# Altium project Cosmic_Luna_Board_Alpha_V0.00.PrjPcb
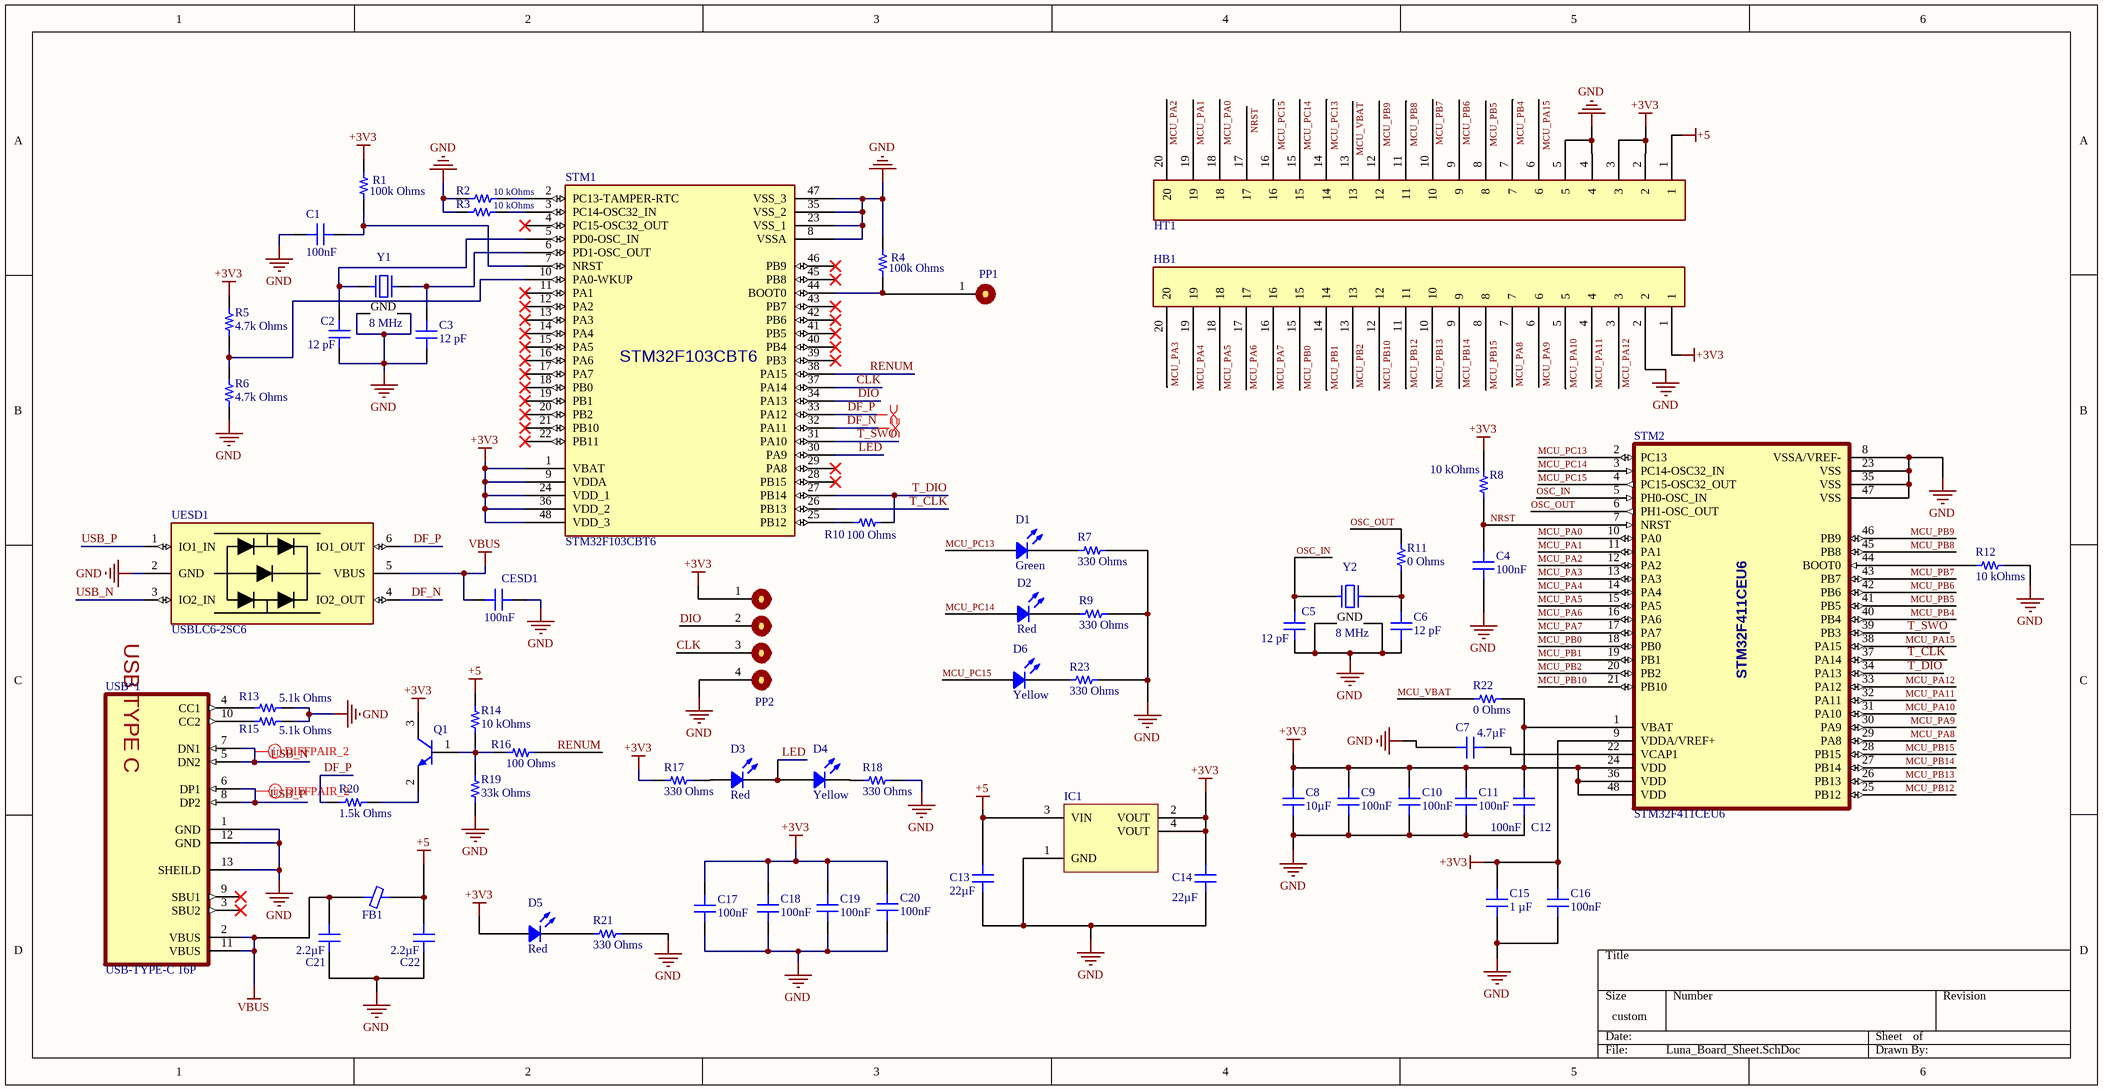
[diagram p0: Luna_Board_Sheet.SchDoc]
1 sheet, 65 parts. Net scope: global (net labels, ports and power ports of the same name join across sheets).
Board file: Luna_Board_PCB_D0.PcbDoc

## Sheet Luna_Board_Sheet.SchDoc
size 393 x 203 mm

### Parts
C1  100nF  [CAP 0603_1608]
C2  12 pF  [CAP 0603_1608]
C3  12 pF  [CAP 0603_1608]
C4  100nF  [CAP 0603_1608]
C5  12 pF  [CAP 0603_1608]
C6  12 pF  [CAP 0603_1608]
C7  4.7µF  [CAP 0603_1608]
C8  10µF  [CAP 0603_1608]
C9  100nF  [CAP 0603_1608]
C10  100nF  [CAP 0603_1608]
C11  100nF  [CAP 0603_1608]
C12  100nF  [CAP 0603_1608]
C13  22µF  [CAP 0805_2012]
C14  22µF  [CAP 0805_2012]
C15  1 µF  [CAP 0603_1608]
C16  100nF  [CAP 0603_1608]
C17  100nF  [CAP 0603_1608]
C18  100nF  [CAP 0603_1608]
C19  100nF  [CAP 0603_1608]
C20  100nF  [CAP 0603_1608]
C21  2.2µF  [CAP 0603_1608]
C22  2.2µF  [CAP 0603_1608]
CESD1  100nF  [CAP 0603_1608]
D1  Green  [LED 0805_2012 GREEN]
D2  Red  [LED 0805_2012 RED]
D3  Red  [LED 0805_2012 RED]
D4  Yellow  [LED 0805_2012 YELLOW]
D5  Red  [LED 0805_2012 RED]
D6  Yellow  [LED 0805_2012 YELLOW]
FB1  Ferrite Bead  [FER 0603_1608]  (value not drawn)
HB1  2.54mm_TH_1x20_pin_header  [2.54mm_TH_1x20_pin_header]  (value not drawn)
HT1  2.54mm_TH_1x20_pin_header  [2.54mm_TH_1x20_pin_header]  (value not drawn)
IC1  AMS1117-3.3  [ST SOT-223]  (value not drawn)
PP1  pin_pad_1  [pinpad_1]  (value not drawn)
PP2  pin_pad_4  [pinpad_4]  (value not drawn)
Q1  500mA NPN BJT  [DIODES SOT-23-3]  (value not drawn)
R1  100k Ohms  [RES 0603_1608]
R2  10 kOhms  [RES 0603_1608]
R3  10 kOhms  [RES 0603_1608]
R4  100k Ohms  [RES 0603_1608]
R5  4.7k Ohms  [RES 0603_1608]
R6  4.7k Ohms  [RES 0603_1608]
R7  330 Ohms  [RES 0603_1608]
R8  10 kOhms  [RES 0603_1608]
R9  330 Ohms  [RES 0603_1608]
R10  100 Ohms  [RES 0603_1608]
R11  0 Ohms  [RES 0603_1608]
R12  10 kOhms  [RES 0603_1608]
R13  5.1k Ohms  [RES 0603_1608]
R14  10 kOhms  [RES 0603_1608]
R15  5.1k Ohms  [RES 0603_1608]
R16  100 Ohms  [RES 0603_1608]
R17  330 Ohms  [RES 0603_1608]
R18  330 Ohms  [RES 0603_1608]
R19  33k Ohms  [RES 0603_1608]
R20  1.5k Ohms  [RES 0603_1608]
R21  330 Ohms  [RES 0603_1608]
R22  0 Ohms  [RES 0603_1608]
R23  330 Ohms  [RES 0603_1608]
STM1  STM32F103CBT6  [STM32F103CBT6_FOOTPRINT]
STM2  STM32F411CEU6  [STM32F411CEU6_Footprint]
UESD1  USBLC6-2SC6  [USBLC6-2SC6_Footprint]
USB*1  USB-TYPE-C 16P  [USB TYPE-C 24P SMD]
Y1  8 MHz  [EPSON TSX-3225]
Y2  8 MHz  [EPSON TSX-3225]

### Nets
+3V3: C8.2 C9.2 C10.2 C11.2 C12.2 C14.2 C15.2 C16.2 C17.2 C18.2 C19.2 C20.2 D5.1 HB1.1 HT1.2 HT1.3 IC1.2(VOUT) IC1.4(VOUT) PP2.1 Q1.3(C) R1.1 R5.2 R8.1 R17.1 R22.1 STM1.1(VBAT) STM1.9(VDDA) STM1.24(VDD_1) STM1.36(VDD_2) STM1.48(VDD_3) STM2.1(VBAT) STM2.9(VDDA/VREF+) STM2.24(VDD) STM2.36(VDD) STM2.48(VDD)
+5: C13.2 C22.1 FB1.1 HT1.1 IC1.3(VIN) R14.2
GND: C1.1 C2.1 C3.1 C4.1 C5.1 C6.1 C7.2 C8.1 C9.1 C10.1 C11.1 C12.1 C13.1 C14.1 C15.1 C16.1 C17.1 C18.1 C19.1 C20.1 C21.2 C22.2 CESD1.1 HB1.2 HT1.4 HT1.5 IC1.1(GND) PP2.4 R2.1 R3.1 R4.1 R6.1 R7.2 R9.2 R12.1 R13.2 R15.2 R18.2 R19.1 R21.2 R23.2 STM1.8(VSSA) STM1.23(VSS_1) STM1.35(VSS_2) STM1.47(VSS_3) STM2.8(VSSA/VREF-) STM2.23(VSS) STM2.35(VSS) STM2.47(VSS) UESD1.2(GND) USB*1.1(GND) USB*1.12(GND) USB*1.13(SHEILD) Y1.2(GND) Y1.4(GND) Y2.2(GND) Y2.4(GND)
VBUS: C21.1 CESD1.2 FB1.2 UESD1.5(VBUS) USB*1.2(VBUS) USB*1.11(VBUS)
CLK: PP2.3 STM1.37(PA14)
DF_N: STM1.32(PA11) UESD1.4(IO2_OUT)
DF_P: R20.1 STM1.33(PA12) UESD1.6(IO1_OUT)
DIO: PP2.2 STM1.34(PA13)
LED: D3.2 D4.1 STM1.30(PA9)
MCU_PA0: HT1.18 STM2.10(PA0)
MCU_PA1: HT1.19 STM2.11(PA1)
MCU_PA2: HT1.20 STM2.12(PA2)
MCU_PA3: HB1.20 STM2.13(PA3)
MCU_PA4: HB1.19 STM2.14(PA4)
MCU_PA5: HB1.18 STM2.15(PA5)
MCU_PA6: HB1.17 STM2.16(PA6)
MCU_PA7: HB1.16 STM2.17(PA7)
MCU_PA8: HB1.7 STM2.29(PA8)
MCU_PA9: HB1.6 STM2.30(PA9)
MCU_PA10: HB1.5 STM2.31(PA10)
MCU_PA11: HB1.4 STM2.32(PA11)
MCU_PA12: HB1.3 STM2.33(PA12)
MCU_PA15: HT1.6 STM2.38(PA15)
MCU_PB0: HB1.15 STM2.18(PB0)
MCU_PB1: HB1.14 STM2.19(PB1)
MCU_PB2: HB1.13 STM2.20(PB2)
MCU_PB4: HT1.7 STM2.40(PB4)
MCU_PB5: HT1.8 STM2.41(PB5)
MCU_PB6: HT1.9 STM2.42(PB6)
MCU_PB7: HT1.10 STM2.43(PB7)
MCU_PB8: HT1.11 STM2.45(PB8)
MCU_PB9: HT1.12 STM2.46(PB9)
MCU_PB10: HB1.12 STM2.21(PB10)
MCU_PB12: HB1.11 STM2.25(PB12)
MCU_PB13: HB1.10 STM2.26(PB13)
MCU_PB14: HB1.9 STM2.27(PB14)
MCU_PB15: HB1.8 STM2.28(PB15)
MCU_PC13: D1.1 HT1.14 STM2.2(PC13)
MCU_PC14: D2.1 HT1.15 STM2.3(PC14-OSC32_IN)
MCU_PC15: D6.1 HT1.16 STM2.4(PC15-OSC32_OUT)
MCU_VBAT: HT1.13 R22.2
NRST: C4.2 HT1.17 R8.2 STM2.7(NRST)
OSC_IN: C5.2 STM2.5(PH0-OSC_IN) Y2.1
OSC_OUT: R11.2 STM2.6(PH1-OSC_OUT)
RENUM: R16.2 STM1.38(PA15)
T_CLK: STM1.26(PB13) STM2.37(PA14)
T_DIO: R10.2 STM1.27(PB14) STM2.34(PA13)
T_SWO: STM1.31(PA10) STM2.39(PB3)
USB_N: UESD1.3(IO2_IN) USB*1.5(DN2) USB*1.7(DN1)
USB_P: UESD1.1(IO1_IN) USB*1.6(DP1) USB*1.8(DP2)
NetC1_2: C1.2 R1.2 STM1.7(NRST)
NetC2_2: C2.2 STM1.5(PD0-OSC_IN) Y1.1
NetC3_2: C3.2 STM1.6(PD1-OSC_OUT) Y1.3
NetC6_2: C6.2 R11.1 Y2.3
NetC7_1: C7.1 STM2.22(VCAP1)
NetD1_2: D1.2 R7.1
NetD2_2: D2.2 R9.1
NetD3_1: D3.1 R17.2
NetD4_2: D4.2 R18.1
NetD5_2: D5.2 R21.1
NetD6_2: D6.2 R23.1
NetPP1_1: PP1.1 R4.2 STM1.44(BOOT0)
NetQ1_1: Q1.1(B) R14.1 R16.1 R19.2
NetQ1_2: Q1.2(E) R20.2
NetR2_2: R2.2 STM1.2(PC13-TAMPER-RTC)
NetR3_2: R3.2 STM1.3(PC14-OSC32_IN)
NetR5_1: R5.1 R6.2 STM1.10(PA0-WKUP)
NetR10_1: R10.1 STM1.25(PB12)
NetR12_2: R12.2 STM2.44(BOOT0)
NetR13_1: R13.1 USB*1.4(CC1)
NetR15_1: R15.1 USB*1.10(CC2)

Not connected (* = marked no-connect by the designer): STM1 4(PC15-OSC32_OUT)* 11(PA1)* 12(PA2)* 13(PA3)* 14(PA4)* 15(PA5)* 16(PA6)* 17(PA7)* 18(PB0)* 19(PB1)* 20(PB2)* 21(PB10)* 22(PB11)* 28(PB15)* 29(PA8)* 39(PB3)* 40(PB4)* 41(PB5)* 42(PB6)* 43(PB7)* 45(PB8)* 46(PB9)*; USB*1 3(SBU2)* 9(SBU1)*

### Layout directives
differential pair: DF_N, DF_P, USB_N, USB_P

### Notes on the sheet
- (in symbol USB TYPE-C 24P SMD) USB TYPE C

### Library data of the parts
C1 C4 C9-C12 C16-C22 CESD1 = 06031C104KAT2A: CAP CER 0.1UF 100V X7R 0603; manufacturer: AVX Corporation; Tolerance: ±10%; Part Number: 06031C104KAT2A; Applications: General Purpose; componentlink1description: Datasheet; componentlink1url: http://datasheets.avx.com/X7RDielectric.pdf; componentlink2description: DigiKey Link; componentlink2url: http://digikey.com/product-detail/en/avx-corporation/06031C104KAT2A/478-10047-1-ND/6564270; Device Package: 0603 (1608 Metric); lastupdated: 9/2/2020 1:03:14 AM; Lifecycle Status: Active; Minimum Order: 1; Mounting Type: Surface Mount, MLCC; Operating Temperature: -55°C ~ 125°C; Package / Case: 0603 (1608 Metric); packaging: TapeAndReel; partid: 14077; Part Status: Active; price: 0.03; series: -; Size / Dimension: 0.063" L x 0.032" W (1.60mm x 0.81mm); Supplier 1: DigiKey; Supplier Part Number 1: 478-10047-1-ND; Temperature Coefficient: X7R; Thickness (Max): 0.037" (0.94mm); Voltage - Rated: 100V
  C1 C4 C9-C12 C16-C20 CESD1: Capacitance: 100nF; value: 100nF
  C21 C22: Capacitance: 2.2µF; value: 2.2µF
C2 C3 C5 C6 = C06CF220F-9ZN-X0T: HIGH-Q MLCC (CF): 0603, 22 PF (1; manufacturer: Knowles Dielectric Labs; Temperature Coefficient: C0G, NP0; Tolerance: ±1%; Voltage - Rated: 250V; Part Number: C06CF220F-9ZN-X0T; Capacitance: 12 pF; Applications: RF, Microwave, High Frequency; componentlink1description: Datasheet; componentlink1url: https://media.digikey.com/pdf/Data%20Sheets/Knowles%20Dielectric%20Labs%20PDFs/MLC_SLC_Cap_Cat.pdf; componentlink2description: DigiKey Link; componentlink2url: https://www.digikey.com/en/products/detail/knowles-dielectric-labs/C06CF220F-9ZN-X0T/19203937; Device Package: 0603 (1608 Metric); Features: High Q, Low Loss; lastupdated: 2/9/2024 8:08:55 PM; Lifecycle Status: Active; Minimum Order: 1; Mounting Type: Surface Mount, MLCC; Operating Temperature: -55°C ~ 125°C; Package / Case: 0603 (1608 Metric); packaging: TapeAndReel; partid: 55085; Part Status: Active; price: 2.56; series: CF; Size / Dimension: 0.060" L x 0.030" W (1.52mm x 0.76mm); Supplier 1: DigiKey; Supplier Part Number 1: 1761-C06CF220F-9ZN-X0TCT-ND; Thickness (Max): 0.031" (0.80mm); value: 12 pF
C7 = 0603ZG475ZAT2A: CAP CER 4.7UF 10V Y5V 0603; manufacturer: AVX Corporation; Temperature Coefficient: Y5V (F); Tolerance: -20%, +80%; Part Number: 0603ZG475ZAT2A; Capacitance: 4.7µF; Applications: General Purpose; componentlink1description: Datasheet; componentlink1url: http://datasheets.avx.com/Y5V.pdf; componentlink2description: DigiKey Link; componentlink2url: http://digikey.com/product-detail/en/avx-corporation/0603ZG475ZAT2A/478-12465-1-ND/9749317; Device Package: 0603 (1608 Metric); lastupdated: 9/2/2020 1:03:34 AM; Lifecycle Status: Active; Minimum Order: 1; Mounting Type: Surface Mount, MLCC; Operating Temperature: -30°C ~ 85°C; Package / Case: 0603 (1608 Metric); packaging: TapeAndReel; partid: 2943; Part Status: Active; price: 0.19; series: -; Size / Dimension: 0.063" L x 0.032" W (1.60mm x 0.81mm); Supplier 1: DigiKey; Supplier Part Number 1: 478-12465-1-ND; value: 4.7µF; Voltage - Rated: 10V
C8 = 0603ZD106KAT2A: CAP CER 10UF 10V X5R 0603; manufacturer: AVX Corporation; Tolerance: ±10%; Part Number: 0603ZD106KAT2A; Capacitance: 10µF; Applications: General Purpose; componentlink1description: Datasheet; componentlink1url: http://datasheets.avx.com/cx5r.pdf; componentlink2description: DigiKey Link; componentlink2url: http://digikey.com/product-detail/en/avx-corporation/0603ZD106KAT2A/478-10766-1-ND/7536554; Device Package: 0603 (1608 Metric); lastupdated: 9/2/2020 1:03:35 AM; Lifecycle Status: Active; Minimum Order: 1; Mounting Type: Surface Mount, MLCC; Operating Temperature: -55°C ~ 85°C; Package / Case: 0603 (1608 Metric); packaging: TapeAndReel; partid: 2590; Part Status: Active; price: 0.08; series: -; Size / Dimension: 0.063" L x 0.032" W (1.60mm x 0.81mm); Supplier 1: DigiKey; Supplier Part Number 1: 478-10766-1-ND; Temperature Coefficient: X5R; Thickness (Max): 0.037" (0.94mm); value: 10µF; Voltage - Rated: 10V
C13 C14 = 0805ZD226MAT2A: CAP CER 22UF 10V X5R 0805; manufacturer: AVX Corporation; Tolerance: ±20%; Part Number: 0805ZD226MAT2A; Capacitance: 22µF; Applications: General Purpose; componentlink1description: Datasheet; componentlink1url: http://datasheets.avx.com/cx5r.pdf; componentlink2description: DigiKey Link; componentlink2url: http://digikey.com/product-detail/en/avx-corporation/0805ZD226MAT2A/478-7966-1-ND/3881589; Device Package: 0805 (2012 Metric); lastupdated: 9/2/2020 1:04:32 AM; Lifecycle Status: Active; Minimum Order: 1; Mounting Type: Surface Mount, MLCC; Operating Temperature: -55°C ~ 85°C; Package / Case: 0805 (2012 Metric); packaging: TapeAndReel; partid: 7750; Part Status: Active; price: 0.10; series: -; Size / Dimension: 0.079" L x 0.049" W (2.00mm x 1.25mm); Supplier 1: DigiKey; Supplier Part Number 1: 478-7966-1-ND; Temperature Coefficient: X5R; Thickness (Max): 0.060" (1.52mm); value: 22µF; Voltage - Rated: 10V
C15 = NMC0603X7R105K16TRPF: CAP SMT06031F16VDC; manufacturer: NIC Components Corp; Temperature Coefficient: X7R; Tolerance: ±10%; Voltage - Rated: 16V; Part Number: NMC0603X7R105K16TRPF; Capacitance: 1 µF; Applications: General Purpose; componentlink1description: Datasheet; componentlink1url: https://www.niccomp.com/quickbuilder/qbpn.php?pNumber=NMC0603X7R105K16TRPF; componentlink2description: DigiKey Link; componentlink2url: https://www.digikey.com/en/products/detail/nic-components-corp/NMC0603X7R105K16TRPF/18895971; Device Package: 0603 (1608 Metric); Features: Low ESL, Low ESR; lastupdated: 2/9/2024 8:08:45 PM; Lifecycle Status: Active; Minimum Order: 1; Mounting Type: Surface Mount, MLCC; Operating Temperature: -55°C ~ 125°C; Package / Case: 0603 (1608 Metric); packaging: TapeAndReel; partid: 55958; price: 0.02; series: NMC High CV; Size / Dimension: 0.063" L x 0.031" W (1.60mm x 0.80mm); Supplier 1: DigiKey; Supplier Part Number 1: 4988-NMC0603X7R105K16TRPFCT-ND; Thickness (Max): 0.039" (1.00mm); value: 1 µF
D1 = QBLP631-YG1-2943: 0805 LED RED 570NM DOMINANT, 565; Manufacturer: QT Brightek (QTB); Configuration: Standard; Current - Test: 20mA; Lens Color: White; Lens Size: 1.30mm x 1.25mm; Lens Style: Rectangle with Flat Top; Lens Transparency: Diffused; Millicandela Rating: 15mcd; Viewing Angle: 140°; Voltage - Forward (Vf) (Typ): 2V; Wavelength - Peak: 565nm; Part Number: QBLP631-YG1-2943; Color: Green; ComponentLink1Description: Datasheet; ComponentLink1URL: https://www.qt-brightek.com/datasheet/QBLP631-YG1-2943.pdf; ComponentLink2Description: DigiKey Link; ComponentLink2URL: https://www.digikey.com/en/products/detail/qt-brightek-qtb/QBLP631-YG1-2943/22106671; Device Package: 0805 (2012 Metric); Height (Max): 0.90mm; LastUpdated: 6/3/2024 8:00:23 PM; Lifecycle Status: Active; Minimum Order: 1; Mounting Type: Surface Mount; Package / Case: 0805 (2012 Metric); Packaging: TapeAndReel; PartId: 1479; Price: 0.05; Series: QBLP631; Size / Dimension: 2.00mm L x 1.25mm W; Supplier 1: DigiKey; Supplier Part Number 1: 1516-QBLP631-YG1-2943CT-ND; Supplier Device Package: 0805; Value: Green; Wavelength - Dominant: 570nm
D2 D3 D5 = QBLP631-S3: 0805 LED RED 640NM DOMINANT, 660; Manufacturer: QT Brightek (QTB); Configuration: Standard; Current - Test: 20mA; Lens Color: Colorless; Lens Size: 1.30mm x 1.25mm; Lens Style: Rectangle with Flat Top; Lens Transparency: Clear; Millicandela Rating: 25mcd; Viewing Angle: 140°; Voltage - Forward (Vf) (Typ): 1.9V; Wavelength - Peak: 660nm; Part Number: QBLP631-S3; Color: Red; ComponentLink1Description: Datasheet; ComponentLink1URL: https://www.qt-brightek.com/datasheet/QBLP631-S3.pdf; ComponentLink2Description: DigiKey Link; ComponentLink2URL: https://www.digikey.com/en/products/detail/qt-brightek-qtb/QBLP631-S3/22106636; Device Package: 0805 (2012 Metric); Height (Max): 0.90mm; LastUpdated: 6/3/2024 8:00:00 PM; Lifecycle Status: Active; Minimum Order: 1; Mounting Type: Surface Mount; Package / Case: 0805 (2012 Metric); Packaging: TapeAndReel; PartId: 1474; Price: 0.08; Series: QBLP631; Size / Dimension: 2.00mm L x 1.25mm W; Supplier 1: DigiKey; Supplier Part Number 1: 1516-QBLP631-S3CT-ND; Supplier Device Package: 0805; Value: Red; Wavelength - Dominant: 640nm
D4 D6 = 597-3222-407NF: LED YELLOW DIFFUSED 0805 SMD; Manufacturer: Dialight; Current - Test: 20mA; Lens Color: White; Lens Size: 1.30mm x 1.25mm; Lens Style: Rectangle with Flat Top; Millicandela Rating: 91mcd; Viewing Angle: 140°; Voltage - Forward (Vf) (Typ): 2.15V; Wavelength - Dominant: 590nm; Part Number: 597-3222-407NF; Color: Yellow; ComponentLink1Description: Datasheet; ComponentLink1URL: https://s3-us-west-2.amazonaws.com/catsy.557/C18700.pdf; ComponentLink2Description: DigiKey Link; ComponentLink2URL: https://www.digikey.com/en/products/detail/dialight/597-3222-407NF/21710484; Device Package: 0805 (2012 Metric); Height (Max): 0.93mm; LastUpdated: 6/3/2024 8:01:22 PM; Lens Transparency: Diffused; Lifecycle Status: Active; Minimum Order: 1; Mounting Type: Surface Mount; Package / Case: 0805 (2012 Metric); Packaging: TapeAndReel; PartId: 1496; Price: 0.08; Series: 597; Size / Dimension: 2.00mm L x 1.25mm W; Supplier 1: DigiKey; Supplier Part Number 1: 350-597-3222-407NFCT-ND; Supplier Device Package: 0805; Value: Yellow
FB1 = BLM18DN601SZ1D: FERRITEBEAD SMD Z100MHZ=600OHM 7; Manufacturer: Murata Electronics; Current Rating (Max): 700mA; Impedance @ Frequency: 600 Ohms @ 100MHz; Number of Lines: 1; Value: 600 Ohms @ 100MHz; Part Number: BLM18DN601SZ1D; ComponentLink1Description: Datasheet; ComponentLink1URL: https://www.murata.com/en-us/api/pdfdownloadapi?cate=luNoiseSupprFilteChipFerriBead&partno=BLM18DN601SZ1%23; ComponentLink2Description: DigiKey Link; ComponentLink2URL: http://digikey.com/product-detail/en/murata-electronics/BLM18DN601SZ1D/490-18575-1-ND/10135586; Device Package: 0603 (1608 Metric); Height (Max): 0.037" (0.95mm); LastUpdated: 9/2/2020 1:18:18 AM; Lifecycle Status: Active; Minimum Order: 1; Mounting Type: Surface Mount; Operating Temperature: -55°C ~ 125°C; Package / Case: 0603 (1608 Metric); Packaging: TapeAndReel; PartId: 783; Part Status: Active; Price: 0.05; Ratings: AEC-Q200; Series: EMIFIL®, BLM18; Size / Dimension: 0.063" L x 0.031" W (1.60mm x 0.80mm); Supplier 1: DigiKey; Supplier Part Number 1: 490-18575-1-ND
IC1 = LDL1117S33R: IC REG LINEAR 3.3V 1.2A SOT223; Manufacturer: STMicroelectronics; Current - Quiescent (Iq): 500 µA; Number of Regulators: 1; Output Configuration: Positive; Output Type: Fixed; Protection Features: Over Current, Over Temperature, Under Voltage Lockout (UVLO); PSRR: 87dB ~ 65dB (120Hz ~ 100kHz); Voltage Dropout (Max): 0.6V @ 1.2A; Voltage - Input (Max): 18V; Part Number: LDL1117S33R; ComponentLink1Description: Datasheet; ComponentLink1URL: http://www.st.com/content/ccc/resource/technical/document/datasheet/group3/0e/5a/00/ca/10/1a/4f/a5/DM00366442/files/DM00366442.pdf/jcr:content/translations/en.DM00366442.pdf; ComponentLink2Description: DigiKey Link; ComponentLink2URL: https://www.digikey.com/en/products/detail/stmicroelectronics/LDL1117S33R/7102071; Current - Output: 1.2A; LastUpdated: 6/3/2024 8:25:59 PM; Lifecycle Status: Active; Minimum Order: 1; Mounting Type: Surface Mount; Operating Temperature: -40°C ~ 125°C (TJ); Package / Case: TO-261-4, TO-261AA; Packaging: TapeAndReel; Part Status: Active; Price: 0.31; Series: -; Supplier 1: DigiKey; Supplier Part Number 1: 497-17239-1-ND; Supplier Device Package: SOT-223; Voltage - Output (Min/Fixed): 3.3V
Q1 = DNLS160-7: TRANS NPN 60V 1A SOT23-3; Manufacturer: Diodes Incorporated; Current - Collector Cutoff (Max): 100nA; DC Current Gain (hFE) (Min) @ Ic, Vce: 200 @ 500mA, 5V; Frequency - Transition: 270MHz; Power - Max: 300mW; Vce Saturation (Max) @ Ib, Ic: 250mV @ 100mA, 1A; Part Number: DNLS160-7; ComponentLink1Description: Datasheet; ComponentLink1URL: https://www.diodes.com/assets/Datasheets/ds31390.pdf; ComponentLink2Description: DigiKey Link; ComponentLink2URL: http://digikey.com/product-detail/en/diodes-incorporated/DNLS160-7/DNLS160DICT-ND/1964776; Current - Collector (Ic) (Max): 1A; LastUpdated: 6/3/2024 8:24:10 PM; Lifecycle Status: Active; Minimum Order: 1; Mounting Type: Surface Mount; Operating Temperature: -55°C ~ 150°C (TJ); Package / Case: TO-236-3, SC-59, SOT-23-3; Packaging: CutTape; PartId: 44; Part Status: Active; Price: 0.45; Series: -; Supplier 1: DigiKey; Supplier Part Number 1: DNLS160DICT-ND; Supplier Device Package: SOT-23-3; Transistor Type: NPN; Voltage - Collector Emitter Breakdown (Max): 60V
R1 R4 = RNCS0603BKE10K0: RES 100K OHM 0.1% 1/16W 0603; Manufacturer: Stackpole Electronics Inc; Power (Watts): 0.063W, 1/16W; Temperature Coefficient: ±25ppm/°C; Part Number: RNCS0603BKE10K0; Value: 100k Ohms; ComponentLink1Description: Datasheet; ComponentLink1URL: https://www.seielect.com/catalog/sei-rncs_rnch.pdf; ComponentLink2Description: DigiKey Link; ComponentLink2URL: https://www.digikey.com/en/products/detail/stackpole-electronics-inc/RNCS0603BKE10K0/1708836; Composition: Thin Film; Device Package: 0603 (1608 Metric); Features: Anti-Corrosive, Automotive AEC-Q200, Moisture Resistant; Height - Seated (Max): 0.022" (0.55mm); LastUpdated: 2/9/2024 8:43:37 PM; Lifecycle Status: Active; Minimum Order: 1; Number of Terminations: 2; Operating Temperature: -55°C ~ 155°C; Package / Case: 0603 (1608 Metric); Packaging: TapeAndReel; PartId: 4838; Part Status: Active; Price: 0.06; Ratings: AEC-Q200; Resistance: 100 kOhms; Series: RNCS; Size / Dimension: 0.061" L x 0.031" W (1.55mm x 0.80mm); Supplier 1: DigiKey; Supplier Part Number 1: RNCS0603BKE10K0CT-ND; Supplier Device Package: 0603; Tolerance: ±0.1%
R2 R3 R7-R9 R12-R21 R23 = RNCS0603BKE10K0: RES 10K OHM 0.1% 1/16W 0603; Manufacturer: Stackpole Electronics Inc; Power (Watts): 0.063W, 1/16W; Temperature Coefficient: ±25ppm/°C; Part Number: RNCS0603BKE10K0; ComponentLink1Description: Datasheet; ComponentLink1URL: https://www.seielect.com/catalog/sei-rncs_rnch.pdf; ComponentLink2Description: DigiKey Link; ComponentLink2URL: https://www.digikey.com/en/products/detail/stackpole-electronics-inc/RNCS0603BKE10K0/1708836; Composition: Thin Film; Device Package: 0603 (1608 Metric); Features: Anti-Corrosive, Automotive AEC-Q200, Moisture Resistant; Height - Seated (Max): 0.022" (0.55mm); LastUpdated: 2/9/2024 8:43:37 PM; Lifecycle Status: Active; Minimum Order: 1; Number of Terminations: 2; Operating Temperature: -55°C ~ 155°C; Package / Case: 0603 (1608 Metric); Packaging: TapeAndReel; PartId: 4838; Part Status: Active; Price: 0.06; Ratings: AEC-Q200; Series: RNCS; Size / Dimension: 0.061" L x 0.031" W (1.55mm x 0.80mm); Supplier 1: DigiKey; Supplier Part Number 1: RNCS0603BKE10K0CT-ND; Supplier Device Package: 0603; Tolerance: ±0.1%
  R2 R3 R8 R12 R14: Value: 10 kOhms; Resistance: 10 kOhms
  R7 R9 R17 R18 R21 R23: Value: 330 Ohms; Resistance: 330 Ohms
  R13 R15: Value: 5.1k Ohms; Resistance: 5.1k Ohms
  R16: Value: 100 Ohms; Resistance: 100 Ohms
  R19: Value: 33k Ohms; Resistance: 33k Ohms
  R20: Value: 1.5k Ohms; Resistance: 1.5k Ohms
R5 = RNCS0603BKE10K0: RES 4.7K OHM 0.1% 1/16W 0603; Manufacturer: Stackpole Electronics Inc; Power (Watts): 0.063W, 1/16W; Temperature Coefficient: ±25ppm/°C; Part Number: RNCS0603BKE10K0; Value: 4.7k Ohms; ComponentLink1Description: Datasheet; ComponentLink1URL: https://www.seielect.com/catalog/sei-rncs_rnch.pdf; ComponentLink2Description: DigiKey Link; ComponentLink2URL: https://www.digikey.com/en/products/detail/stackpole-electronics-inc/RNCS0603BKE10K0/1708836; Composition: Thin Film; Device Package: 0603 (1608 Metric); Features: Anti-Corrosive, Automotive AEC-Q200, Moisture Resistant; Height - Seated (Max): 0.022" (0.55mm); LastUpdated: 2/9/2024 8:43:37 PM; Lifecycle Status: Active; Minimum Order: 1; Number of Terminations: 2; Operating Temperature: -55°C ~ 155°C; Package / Case: 0603 (1608 Metric); Packaging: TapeAndReel; PartId: 4838; Part Status: Active; Price: 0.06; Ratings: AEC-Q200; Resistance: 4.7k Ohms; Series: RNCS; Size / Dimension: 0.061" L x 0.031" W (1.55mm x 0.80mm); Supplier 1: DigiKey; Supplier Part Number 1: RNCS0603BKE10K0CT-ND; Supplier Device Package: 0603; Tolerance: ±0.1%
R6 = RNCS0603BKE10K0: RES 4.7k OHM 0.1% 1/16W 0603; Manufacturer: Stackpole Electronics Inc; Power (Watts): 0.063W, 1/16W; Temperature Coefficient: ±25ppm/°C; Part Number: RNCS0603BKE10K0; Value: 4.7k Ohms; ComponentLink1Description: Datasheet; ComponentLink1URL: https://www.seielect.com/catalog/sei-rncs_rnch.pdf; ComponentLink2Description: DigiKey Link; ComponentLink2URL: https://www.digikey.com/en/products/detail/stackpole-electronics-inc/RNCS0603BKE10K0/1708836; Composition: Thin Film; Device Package: 0603 (1608 Metric); Features: Anti-Corrosive, Automotive AEC-Q200, Moisture Resistant; Height - Seated (Max): 0.022" (0.55mm); LastUpdated: 2/9/2024 8:43:37 PM; Lifecycle Status: Active; Minimum Order: 1; Number of Terminations: 2; Operating Temperature: -55°C ~ 155°C; Package / Case: 0603 (1608 Metric); Packaging: TapeAndReel; PartId: 4838; Part Status: Active; Price: 0.06; Ratings: AEC-Q200; Resistance: 4.7k Ohms; Series: RNCS; Size / Dimension: 0.061" L x 0.031" W (1.55mm x 0.80mm); Supplier 1: DigiKey; Supplier Part Number 1: RNCS0603BKE10K0CT-ND; Supplier Device Package: 0603; Tolerance: ±0.1%
R10 = RNCS0603BKE10K0: RES 100 OHM 0.1% 1/16W 0603; Manufacturer: Stackpole Electronics Inc; Power (Watts): 0.063W, 1/16W; Temperature Coefficient: ±25ppm/°C; Part Number: RNCS0603BKE10K0; Value: 100 Ohms; ComponentLink1Description: Datasheet; ComponentLink1URL: https://www.seielect.com/catalog/sei-rncs_rnch.pdf; ComponentLink2Description: DigiKey Link; ComponentLink2URL: https://www.digikey.com/en/products/detail/stackpole-electronics-inc/RNCS0603BKE10K0/1708836; Composition: Thin Film; Device Package: 0603 (1608 Metric); Features: Anti-Corrosive, Automotive AEC-Q200, Moisture Resistant; Height - Seated (Max): 0.022" (0.55mm); LastUpdated: 2/9/2024 8:43:37 PM; Lifecycle Status: Active; Minimum Order: 1; Number of Terminations: 2; Operating Temperature: -55°C ~ 155°C; Package / Case: 0603 (1608 Metric); Packaging: TapeAndReel; PartId: 4838; Part Status: Active; Price: 0.06; Ratings: AEC-Q200; Resistance: 100 Ohms; Series: RNCS; Size / Dimension: 0.061" L x 0.031" W (1.55mm x 0.80mm); Supplier 1: DigiKey; Supplier Part Number 1: RNCS0603BKE10K0CT-ND; Supplier Device Package: 0603; Tolerance: ±0.1%
R11 R22 = TLRZ1JTTD: RES 0 OHM JUMPER 0603; Manufacturer: KOA Speer Electronics, Inc.; Part Number: TLRZ1JTTD; Value: 0 Ohms; ComponentLink1Description: Datasheet; ComponentLink1URL: http://www.koaspeer.com/catimages/Products/TLRZ/TLRZ.pdf; ComponentLink2Description: DigiKey Link; ComponentLink2URL: https://www.digikey.com/en/products/detail/koa-speer-electronics-inc/TLRZ1JTTD/9845493; Composition: Metal Element; Device Package: 0603 (1608 Metric); Features: Automotive AEC-Q200, Current Sense; Height - Seated (Max): 0.022" (0.55mm); LastUpdated: 2/9/2024 8:43:37 PM; Lifecycle Status: Active; Minimum Order: 1; Number of Terminations: 2; Operating Temperature: -55°C ~ 170°C; Package / Case: 0603 (1608 Metric); Packaging: TapeAndReel; PartId: 4851; Part Status: Active; Price: 0.08; Ratings: AEC-Q200; Resistance: 0 Ohms; Series: TLRZ; Size / Dimension: 0.063" L x 0.031" W (1.60mm x 0.80mm); Supplier 1: DigiKey; Supplier Part Number 1: 2019-TLRZ1JTTDCT-ND; Supplier Device Package: 0603; Tolerance: Jumper
STM1 = STM32F103CBT6: 128KB 2V~3.6V ARM-M3 20KB 72MHz FLASH 37 LQFP-48(7x7) Microcontrollers (MCU/MPU/SOC) ROHS; JLCPCB Part #: C8304; Package: LQFP-48; MFR.Part #: STM32F103CBT6; ComponentLink1Description: Datasheet; ComponentLink1URL: https://www.st.com/resource/en/datasheet/cd00161566.pdf; ComponentLink2Description: JLCPCB Parts; ComponentLink2URL: https://jlcpcb.com/partdetail/Stmicroelectronics-STM32F103CBT6/C8304
UESD1 = USBLC6-2: The USBLC6-2SC6 and USBLC6-2P6 are / monolithic application specific devices dedicated / to ESD protection of high speed interfaces, such / as USB 2.0, Ethernet links and video lines. / The very low line capacitance secures a high level / of signal integrity without compromising in / protecting sensitive chips against the most / stringently characterized ESD strikes.; ComponentLink1Description: JLCPCB; ComponentLink1URL: https://jlcpcb.com/partdetail/Stmicroelectronics-USBLC62SC6/C7519; ComponentLink2Description: Datasheet; ComponentLink2URL: https://www.st.com/resource/en/datasheet/usblc6-2.pdf; JLCPCB Part #: C7519
USB*1 = USB TYPE-C 24P SMD: USB Type: TYPE-C 16PIN / 24PIN; Gender: Female; Current Rating: 5 Amp; Voltage Rating: 3.3V - 48V; Pin Number: 16; ComponentLink1Description: lcsc; ComponentLink1URL: https://www.lcsc.com/product-detail/USB-Connectors_SHOU-HAN-TYPE-C-16PIN-2MD-073_C2765186.html; ComponentLink2Description: datasheet 1; ComponentLink2URL: https://www.lcsc.com/datasheet/lcsc_datasheet_2111231930_SHOU-HAN-TYPE-C-16PIN-2MD-073_C2765186.pdf; ComponentLink3Description: datasheet 2; ComponentLink3URL: https://www.digikey.com/en/products/detail/gct/USB4105-GF-A/11198441; ComponentLink4Description: aliexpress; ComponentLink4URL: https://www.aliexpress.com/item/1005006353547160.html?spm=a2g0o.order_list.order_list_main.61.296f18023vUA5z; LCSC Part: C2765186; Stock: ~30
Y1 = TSX-3225 16.0000MF10U-B0: Manufacturer: EPSON; ESR (Equivalent Series Resistance): 60 Ohms; Frequency Stability: ±10ppm; Load Capacitance: 16pF; Operating Mode: Fundamental; Part Number: TSX-3225 16.0000MF10U-B0; ComponentLink1Description: Datasheet; ComponentLink1URL: https://support.epson.biz/td/api/doc_check.php?dl=brief_TSX-3225&lang=en; ComponentLink2Description: DigiKey Link; ComponentLink2URL: https://www.digikey.com/en/products/detail/epson/TSX-3225-16-0000MF10U-B0/5260851; Frequency: 8 MHz; Frequency Tolerance: ±10ppm; Height - Seated (Max): 0.024" (0.60mm); LastUpdated: 6/3/2024 8:02:15 PM; Lifecycle Status: Active; Minimum Order: 1; Mounting Type: Surface Mount; Operating Temperature: -10°C ~ 60°C; Package / Case: 4-SMD, No Lead; Packaging: TapeAndReel; PartId: 436; Part Status: Active; Price: 0.20; Series: TSX-3225; Size / Dimension: 0.126" L x 0.098" W (3.20mm x 2.50mm); Supplier 1: DigiKey; Supplier Part Number 1: SER4370CT-ND; Type: MHz Crystal; Value: 8 MHz
Y2 = TSX-3225 16.0000MF10U-B0: CRYSTAL 16.0000MHZ 16PF SMD; Manufacturer: EPSON; ESR (Equivalent Series Resistance): 60 Ohms; Frequency: 16 MHz; Frequency Stability: ±10ppm; Operating Mode: Fundamental; Part Number: TSX-3225 16.0000MF10U-B0; ComponentLink1Description: Datasheet; ComponentLink1URL: https://support.epson.biz/td/api/doc_check.php?dl=brief_TSX-3225&lang=en; ComponentLink2Description: DigiKey Link; ComponentLink2URL: https://www.digikey.com/en/products/detail/epson/TSX-3225-16-0000MF10U-B0/5260851; Frequency Tolerance: ±10ppm; Height - Seated (Max): 0.024" (0.60mm); LastUpdated: 6/3/2024 8:02:15 PM; Lifecycle Status: Active; Load Capacitance: 16pF; Minimum Order: 1; Mounting Type: Surface Mount; Operating Temperature: -10°C ~ 60°C; Package / Case: 4-SMD, No Lead; Packaging: TapeAndReel; PartId: 436; Part Status: Active; Price: 0.20; Series: TSX-3225; Size / Dimension: 0.126" L x 0.098" W (3.20mm x 2.50mm); Supplier 1: DigiKey; Supplier Part Number 1: SER4370CT-ND; Type: MHz Crystal; Value: 8 MHz